# EAGLE schematic LEDCLOCK (EAGLE 7.0.0)
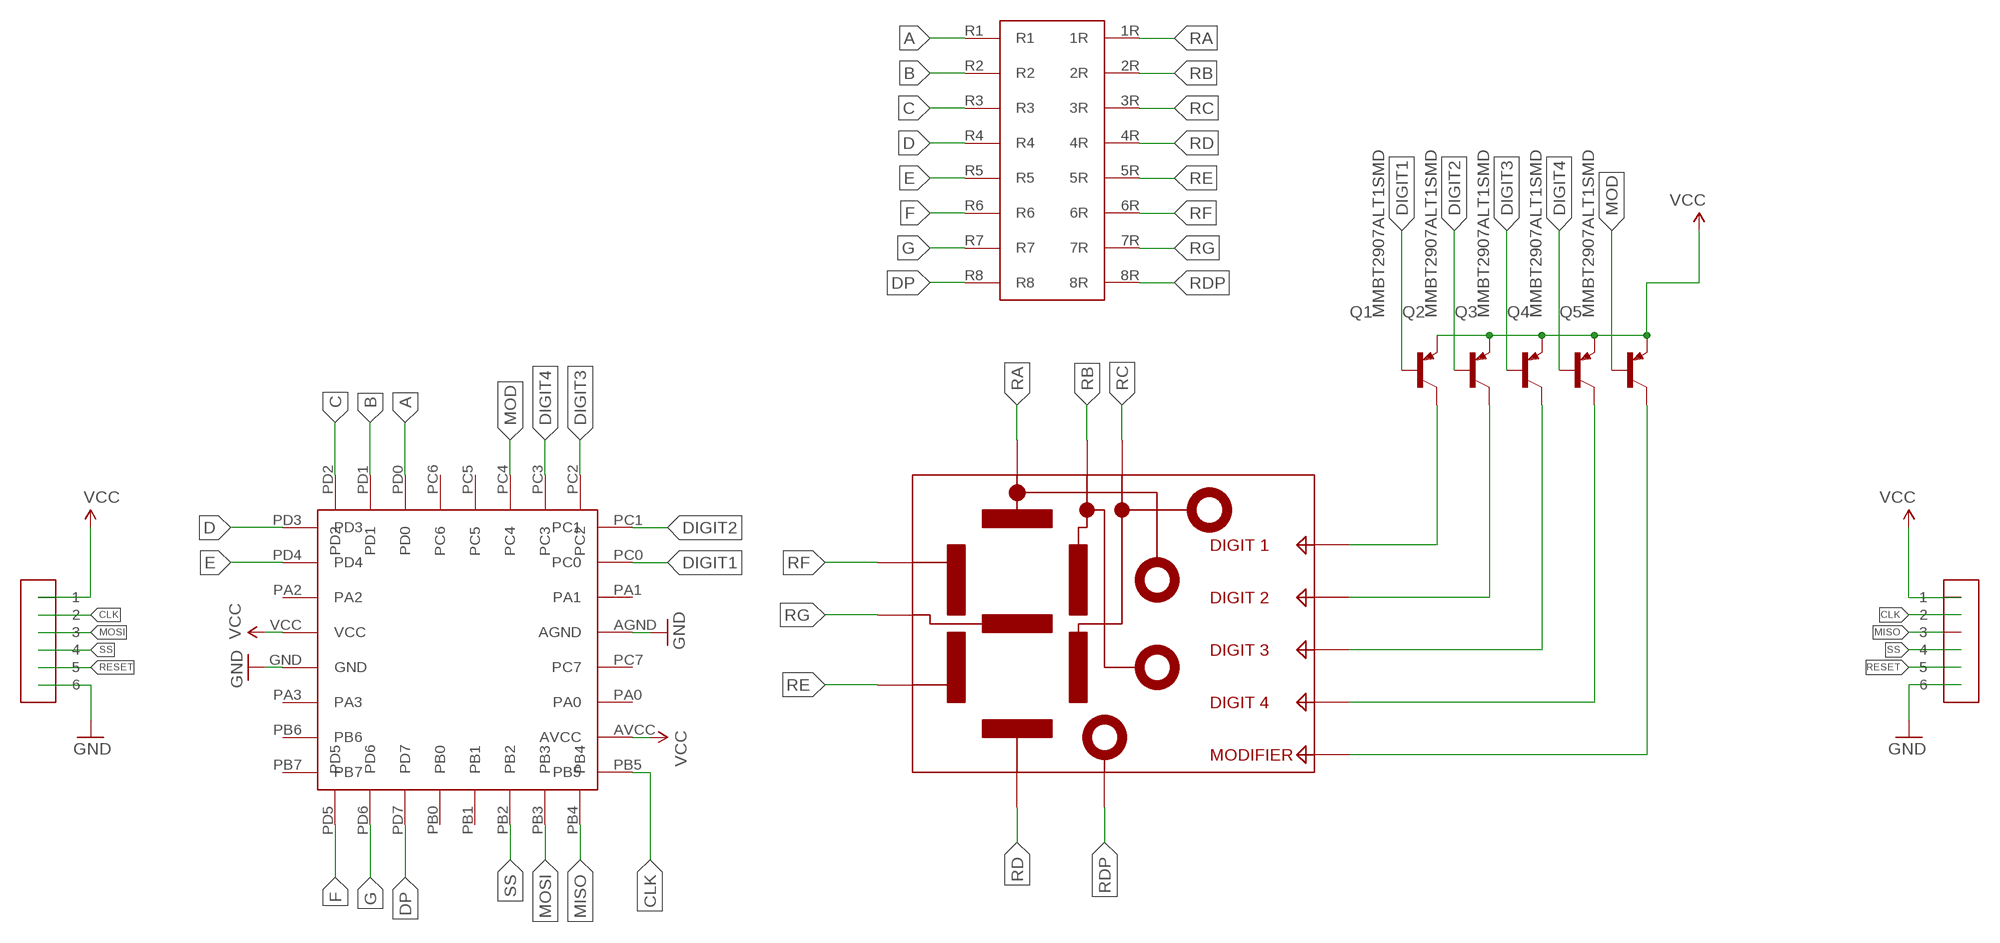
[diagram p0: schematic, sheet 1]

## Parts
Q1  MMBT2907ALT1SMD  [SOT23-BEC]
Q2  MMBT2907ALT1SMD  [SOT23-BEC]
Q3  MMBT2907ALT1SMD  [SOT23-BEC]
Q4  MMBT2907ALT1SMD  [SOT23-BEC]
Q5  MMBT2907ALT1SMD  [SOT23-BEC]
U$1  LEDCLOCK  [LEDCLOCK]
U$2  DIP1X6MALE  [DIP1X6MALE]
U$3  RES_ARRAY  [RES_ARRAY]
U$4  DIP1X6MALE  [DIP1X6MALE]
U$5  ATTINY48  [ATTINY48]

## Nets
A: U$3.R1 U$5.PD0
B: U$3.R2 U$5.PD1
C: U$3.R3 U$5.PD2
CLK: U$2.2 U$4.2 U$5.PB5
D: U$3.R4 U$5.PD3
DIGIT1: Q1.B U$5.PC0
DIGIT2: Q2.B U$5.PC1
DIGIT3: Q3.B U$5.PC2
DIGIT4: Q4.B U$5.PC3
DP: U$3.R8 U$5.PD7
E: U$3.R5 U$5.PD4
F: U$3.R6 U$5.PD5
G: U$3.R7 U$5.PD6
GND: U$2.6 U$4.6 U$5.AGND U$5.GND
MISO: U$5.PB4
MOD: Q5.B U$5.PC4
MOSI: U$2.3 U$5.PB3
N$1: Q1.C U$1.1(DIGIT1)
N$2: Q2.C U$1.2(DIGIT2)
N$3: Q3.C U$1.6(DIGIT3)
N$4: Q4.C U$1.8(DIGIT4)
N$5: Q5.C U$1.4(MOD)
RA: U$1.14(A) U$3.1R
RB: U$1.16(B) U$3.2R
RC: U$1.13(C) U$3.3R
RD: U$1.3(D) U$3.4R
RDP: U$1.7(DP) U$3.8R
RE: U$1.5(E) U$3.5R
RESET: U$2.5 U$4.5
RF: U$1.11(F) U$3.6R
RG: U$1.15(G) U$3.7R
SS: U$2.4 U$4.4 U$5.PB2
VCC: Q1.E Q2.E Q3.E Q4.E Q5.E U$2.1 U$4.1 U$5.AVCC U$5.VCC
Unconnected: U$4.3 U$5.PA0 U$5.PA1 U$5.PA2 U$5.PA3 U$5.PB0 U$5.PB1 U$5.PB6 U$5.PB7 U$5.PC5 U$5.PC6 U$5.PC7

## Library data of the parts
Q1-Q5 = transistor-pnp:MMBT2907*: PNP Transistror
U$1 = ScottSilver:LEDCLOCK
U$2 U$4 = ScottSilver:DIP1X6MALE
U$3 = ScottSilver:RES_ARRAY
U$5 = ScottSilver:ATTINY48